# Altium schematic sheet Module.SchDoc
size A3; SheetNumber: 29; SheetTotal: 30
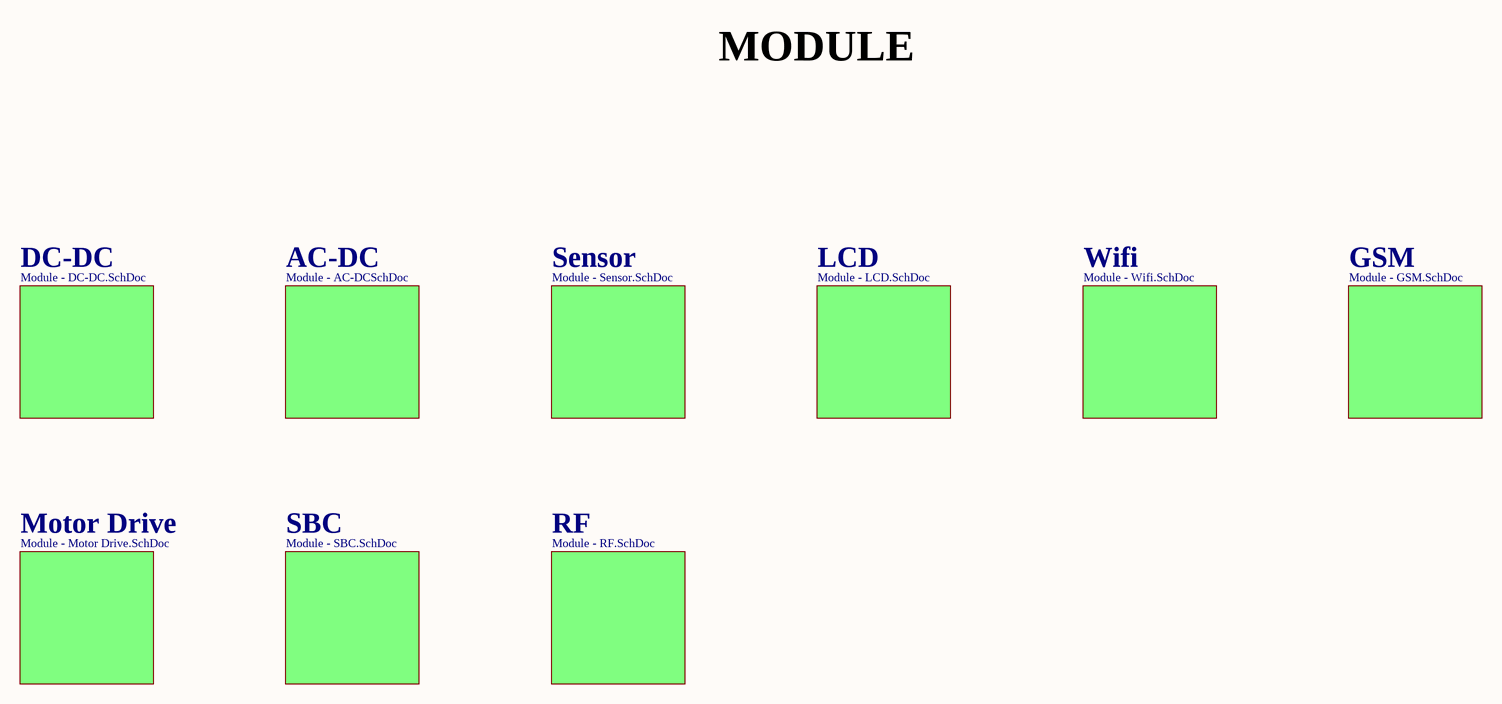
[diagram p0: Module.SchDoc]

## Sub-sheets
AC-DC = Module - AC-DCSchDoc: no entries
DC-DC = Module - DC-DC.SchDoc: no entries
GSM = Module - GSM.SchDoc: no entries
LCD = Module - LCD.SchDoc: no entries
Motor Drive = Module - Motor Drive.SchDoc: no entries
RF = Module - RF.SchDoc: no entries
SBC = Module - SBC.SchDoc: no entries
Sensor = Module - Sensor.SchDoc: no entries
Wifi = Module - Wifi.SchDoc: no entries

## Notes on the sheet
- MODULE